# EAGLE design scheme (EAGLE 6.4)
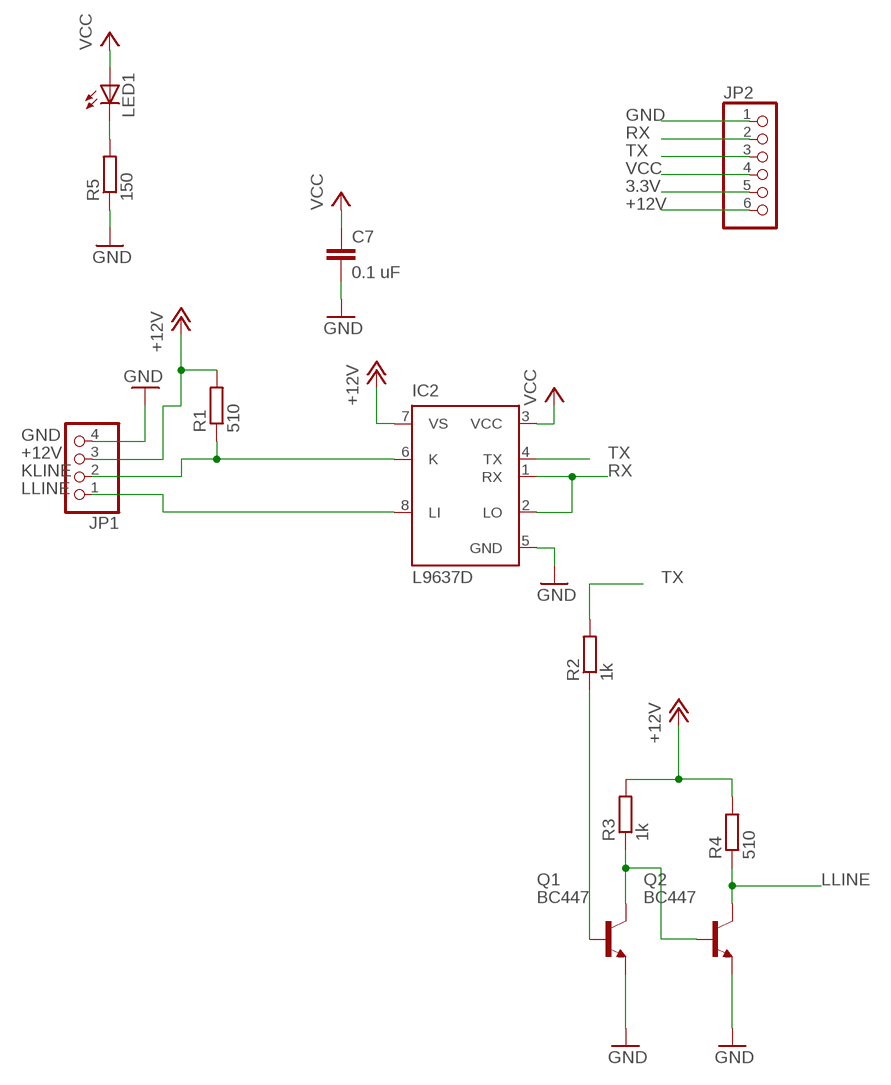
[diagram p0: schematic, sheet 1]

## Parts
C7  0.1 uF  C-EUC0805K  [C0805K]
IC2  L9637D  [SO08]
JP1  PINHD-1X4  [1X04]
JP2  PINHD-1X6  [1X06]
LED1  LEDSML1206  [SML1206]
Q1  BC447  [TO92-EBC]
Q2  BC447  [TO92-EBC]
R1  510  R-EU_R0805  [R0805]
R2  1k  R-EU_R0805  [R0805]
R3  1k  R-EU_R0805  [R0805]
R4  510  R-EU_R0805  [R0805]
R5  150  R-EU_R0805  [R0805]

## Nets
3.3V: JP2.5
+12V: IC2.7(VS) JP1.3 JP2.6 R1.2 R3.2 R4.2
GND: C7.2 IC2.5(GND) JP1.4 JP2.1 Q1.E Q2.E R5.1
KLINE: IC2.6(K) JP1.2 R1.1
LLINE: IC2.8(LI) JP1.1 Q2.C R4.1
N$10: LED1.C R5.2
N$12: Q1.B R2.1
N$16: Q1.C Q2.B R3.1
RX: IC2.1(RX) IC2.2(LO) JP2.2
TX: IC2.4(TX) JP2.3 R2.2
VCC: C7.1 IC2.3(VCC) JP2.4 LED1.A

## Library data of the parts
C7 = resistor:C-EU: CAPACITOR, European symbol
IC2 = st-microelectronics:L9637D: ISO 9141 INTERFACE Source: 1765.pdf; MPN: L9637D; OC_FARNELL: unknown; OC_NEWARK: 56P8926
JP1 = pinhead:PINHD-1X4: PIN HEADER
JP2 = pinhead:PINHD-1X6: PIN HEADER
LED1 = led:LED: LED OSRAM: - CHIPLED LG R971, LG N971, LY N971, LG Q971, LY Q971, LO R971, LY R971 LH N974, LH R974 LS Q976, LO Q976, LY Q976 LO Q996 - Hyper CHIPLED LW Q18S LB Q993, LB Q99A, LB R99A - SideLED LS A670, LO A670, LY A670, LG A670, LP A670 LB A673, LV A673, LT A673, LW A673 LH A674 LY A675 LS A676, LA A676, LO A676, LY A676, LW A676 LS A679, LY A679, LG A679 - Hyper Micro SIDELED® LS Y876, LA Y876, LO Y876, LY Y876 LT Y87S - SmartLED LW L88C, LW L88S LB L89C, LB L89S, LG L890 LS L89K, LO L89K, LY L89K LS L896, LA L896, LO L896, LY L896 - TOPLED LS T670, LO T670, LY T670, LG T670, LP T670 LSG T670, LSP T670, LSY T670, LOP T670, LYG T670 LG T671, LOG T671, LSG T671 LB T673, LV T673, LT T673, LW T673 LH T674 LS T676, LA T676, LO T676, LY T676, LB T676, LH T676, LSB T676, LW T676 LB T67C, LV T67C, LT T67C, LS T67K, LO T67K, LY T67K, LW E67C LS E67B, LA E67B, LO E67B, LY E67B, LB E67C, LV E67C, LT E67C LW T67C LS T679, LY T679, LG T679 LS T770, LO T770, LY T770, LG T770, LP T770 LB T773, LV T773, LT T773, LW T773 LH T774 LS E675, LA E675, LY E675, LS T675 LS T776, LA T776, LO T776, LY T776, LB T776 LHGB T686 LT T68C, LB T68C - Hyper Mini TOPLED® LB M676 - Mini TOPLED Santana® LG M470 LS M47K, LO M47K, LY M47K Source: http://www.osram.convergy.de LUXEON: - LUMILED® LXK2-PW12-R00, LXK2-PW12-S00, LXK2-PW14-U00, LXK2-PW14-V00 LXK2-PM12-R00, LXK2-PM12-S00, LXK2-PM14-U00 LXK2-PE12-Q00, LXK2-PE12-R00, LXK2-PE12-S00, LXK2-PE14-T00, LXK2-PE14-U00 LXK2-PB12-K00, LXK2-PB12-L00, LXK2-PB12-M00, LXK2-PB14-N00, LXK2-PB14-P00, LXK2-PB14-Q00 LXK2-PR12-L00, LXK2-PR12-M00, LXK2-PR14-Q00, LXK2-PR14-R00 LXK2-PD12-Q00, LXK2-PD12-R00, LXK2-PD12-S00 LXK2-PH12-R00, LXK2-PH12-S00 LXK2-PL12-P00, LXK2-PL12-Q00, LXK2-PL12-R00 Source: www.luxeon.com KINGBRIGHT: KA-3528ASYC Source: www.kingbright.com
Q1 Q2 = transistor-npn:BC447*: NPN Transistor
R1-R5 = resistor:R-EU_: RESISTOR, European symbol

## Board
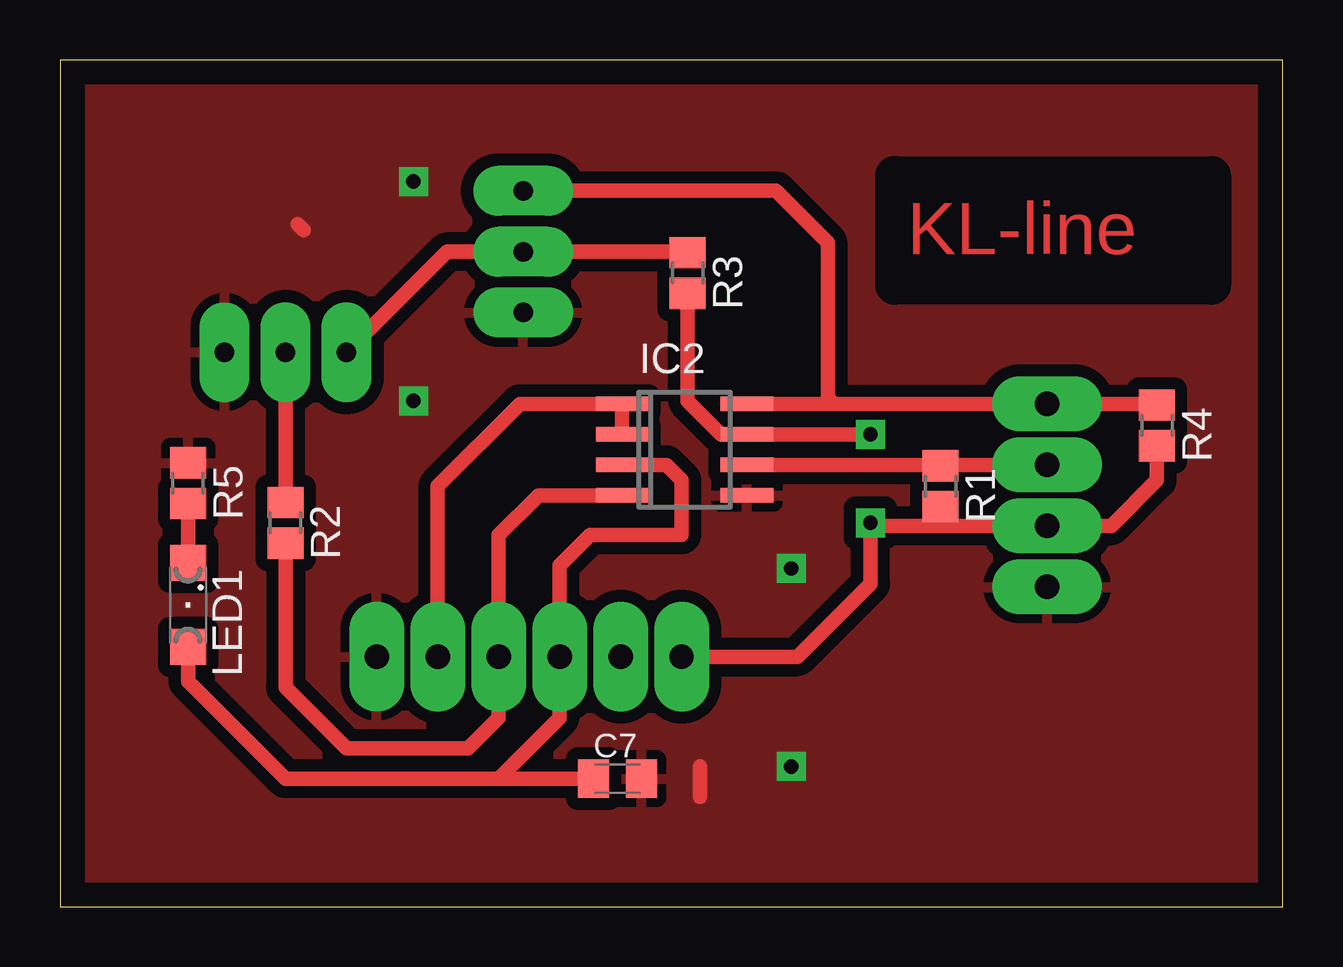
[diagram p1: board, top side]
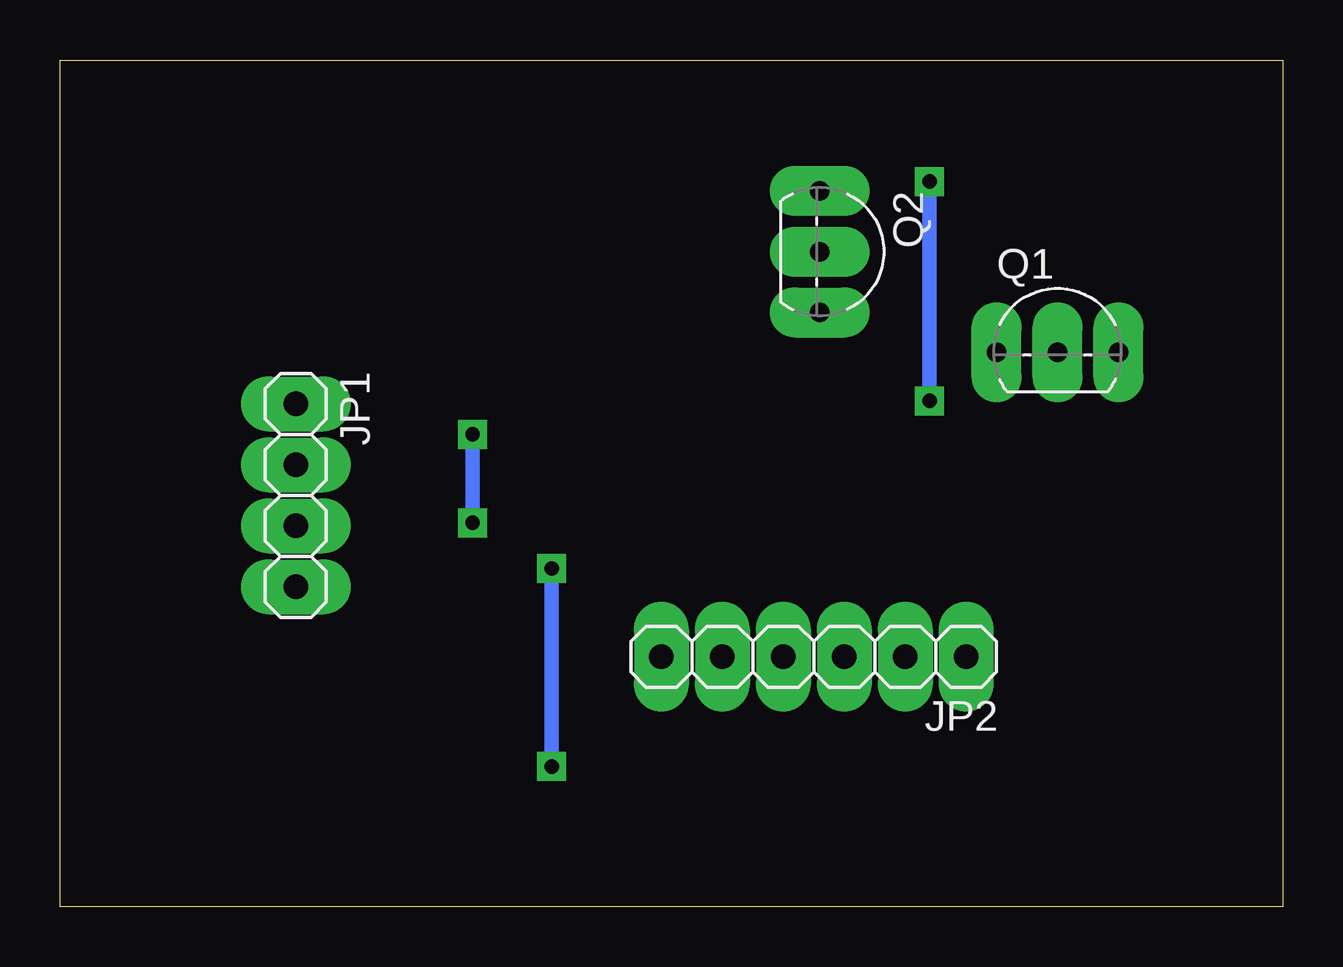
[diagram p2: board, bottom side, seen from below]

Size 50.98 x 35.3 mm. Coordinates in mm from the lower left corner, seen from the top.
Outline: 0,0 50.98,0 50.98,35.3 0,35.3 0,0
Copper layers (1*16): Top 0.035mm / dielectric 1.5mm / Bottom 0.035mm
Design rules "default": minimum track width 10mil, minimum drill 32mil, track to track 12mil, track to pad 12mil, pad to pad 12mil, via to via 12mil, smd to smd 8mil, copper to edge 40mil, drill to drill 40mil, minimum pad ring 25mil, minimum via ring 12mil, stop-mask expansion 4mil, vias tented up to drill 0mil, thermal gap 15mil
tRestrict: area 34.8,25.9 to 48,30.5

### Footprints (pad centres in the part's own frame; a part is rotated, then mirrored left to right if it is on the bottom)
C0805K = smd 1.3 x 1.6: 1 -1,0; 2 1,0
SO08 = smd 0.6 x 2.2: 1 -1.905,-2.6; 2 -0.635,-2.6; 3 0.635,-2.6; 4 1.905,-2.6; 5 1.905,2.6; 6 0.635,2.6; 7 -0.635,2.6; 8 -1.905,2.6
1X04 = drill 1.016 long: 1 -3.81,0; 2 -1.27,0; 3 1.27,0; 4 3.81,0
1X06 = drill 1.016 long: 1 -6.35,0; 2 -3.81,0; 3 -1.27,0; 4 1.27,0; 5 3.81,0; 6 6.35,0
SML1206 = smd 1.5 x 1.5: A 1.75,0; C -1.75,0
TO92-EBC = drill 0.813 long: B 0,-1.27; C -2.54,-1.27; E 2.54,-1.27
R0805 = smd 1.3 x 1.5: 1 -0.85,0; 2 0.85,0

### Placement (x,y rotation side)
C7  23.24,5.33 0 top
IC2  26.03,19.05 270 top
JP1  41.15,17.14 270 bottom
JP2  19.56,10.41 180 bottom
LED1  5.33,12.57 270 top
Q1  9.4,24.38 0 bottom
Q2  18.03,27.3 270 bottom
R1  36.7,17.53 270 top
R2  9.4,16 270 top
R3  26.16,26.42 270 top
R4  45.72,20.07 270 top
R5  5.33,17.65 270 top

### Tracks (layer width: path | path; a pad name or v marks a point on that pad's centre or on a via)
+12V  (via drill 0.6)
  Top 0.61: v33.78,19.68 IC2.7 27.56,19.68 26.16,21.08 R3.2 | JP2.6 30.73,10.41 33.78,13.46 v33.78,16 33.78,15.88 36.58,15.88 | R4.2 45.72,17.78 43.81,15.88 JP1.3 36.58,15.88 | R1.2 36.58,16.68 36.58,15.88
  Bottom 0.61: v33.78,19.68 v33.78,16
GND  (via drill 0.6)
  Top 0.61: 10.16,28.19 9.91,28.45 | 26.67,5.84 26.67,4.57
  Bottom 0.61: v14.73,21.08 v14.73,30.23 | v30.48,14.1 v30.48,5.84
  pour Top (isolate 0.508): -8.13,54.1 79.76,54.1 79.76,-2.29 -8.13,-2.29
KLINE
  Top 0.61: JP1.2 36.7,18.41 | 36.7,18.41 R1.1 | 36.7,18.41 IC2.6
LLINE
  Top 0.61: IC2.8 32.26,20.95 | 32.26,20.95 JP1.1 45.68,20.95 R4.1 | Q2.C 29.84,29.84 32,27.69 32,21.21 32.26,20.95
N$10
  Top 0.61: LED1.C R5.2
N$12
  Top 0.61: R2.1 Q1.B
N$16
  Top 0.61: R3.1 26.12,27.3 Q2.B 16.13,27.3 Q1.C
RX
  Top 0.61: JP2.2 15.75,17.53 19.18,20.95 IC2.1 IC2.2
TX
  Top 0.61: R2.2 9.4,9.14 11.94,6.6 17.02,6.6 18.29,7.87 JP2.3 18.29,15.49 19.94,17.14 IC2.4
VCC
  Top 0.61: 18.29,5.33 20.83,7.87 JP2.4 20.83,14.22 22.1,15.49 25.91,15.49 25.91,17.78 25.27,18.41 IC2.3 | 18.29,5.33 9.4,5.33 5.33,9.4 LED1.A | C7.1 18.29,5.33

### Text on the board
Top: KL-line